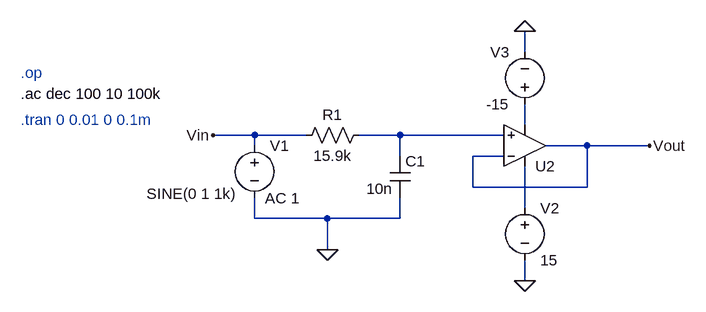
[diagram p0: schematic Active 1st order LPF.asc]
Active 1st order LPF.asc, the LTspice schematic file:
Version 4.1
SHEET 1 880 680
WIRE 336 0 336 -32
WIRE 336 112 336 80
WIRE -80 128 -144 128
WIRE 0 128 -80 128
WIRE 144 128 80 128
WIRE 304 128 144 128
WIRE -80 144 -80 128
WIRE 432 144 368 144
WIRE 528 144 432 144
WIRE 144 160 144 128
WIRE 304 160 256 160
WIRE 256 208 256 160
WIRE 432 208 432 144
WIRE 432 208 256 208
WIRE 336 240 336 176
WIRE -80 256 -80 224
WIRE 32 256 -80 256
WIRE 144 256 144 224
WIRE 144 256 32 256
WIRE 32 304 32 256
WIRE 336 352 336 320
FLAG -144 128 Vin
FLAG 528 144 Vout
FLAG 32 304 0
FLAG 336 352 0
FLAG 336 -32 0
SYMBOL res 96 112 R90
WINDOW 0 0 56 VBottom 2
WINDOW 3 32 56 VTop 2
SYMATTR InstName R1
SYMATTR Value 15.9k
SYMBOL cap 128 160 R0
WINDOW 3 -36 50 Left 2
SYMATTR Value 10n
SYMATTR InstName C1
SYMBOL voltage -80 128 R0
WINDOW 3 -166 90 Left 2
WINDOW 123 16 97 Left 2
WINDOW 39 0 0 Left 0
SYMATTR Value SINE(0 1 1k)
SYMATTR Value2 AC 1
SYMATTR InstName V1
SYMBOL OpAmps\\UniversalOpAmp2 336 144 M180
SYMATTR InstName U2
SYMBOL voltage 336 224 R0
WINDOW 123 0 0 Left 0
WINDOW 39 0 0 Left 0
SYMATTR InstName V2
SYMATTR Value 15
SYMBOL voltage 336 96 R180
WINDOW 0 24 96 Left 2
WINDOW 3 24 16 Left 2
WINDOW 123 0 0 Left 0
WINDOW 39 0 0 Left 0
SYMATTR InstName V3
SYMATTR Value -15
TEXT -440 32 Left 2 ;.op
TEXT -440 64 Left 2 !.ac dec 100 10 100k
TEXT -440 104 Left 2 ;.tran 0 0.01 0 0.1m

The netlist it stands for:
* Active 1st order LPF.asc
R1 N002 Vin 15.9k
C1 N002 0 10n
V1 Vin 0 SINE(0 1 1k) AC 1
X§U2 N002 Vout N003 N001 Vout level2 Avol=1Meg GBW=10Meg Slew=10Meg Ilimit=25m Rail=0 Vos=0 En=0 Enk=0 In=0 Ink=0 Rin=500Meg  ; pins In+ In- V+ V- OUT
V2 N003 0 15
V3 N001 0 -15
* .op
.ac dec 100 10 100k
* .tran 0 0.01 0 0.1m
.lib UniversalOpAmp2.lib
.backanno
.end